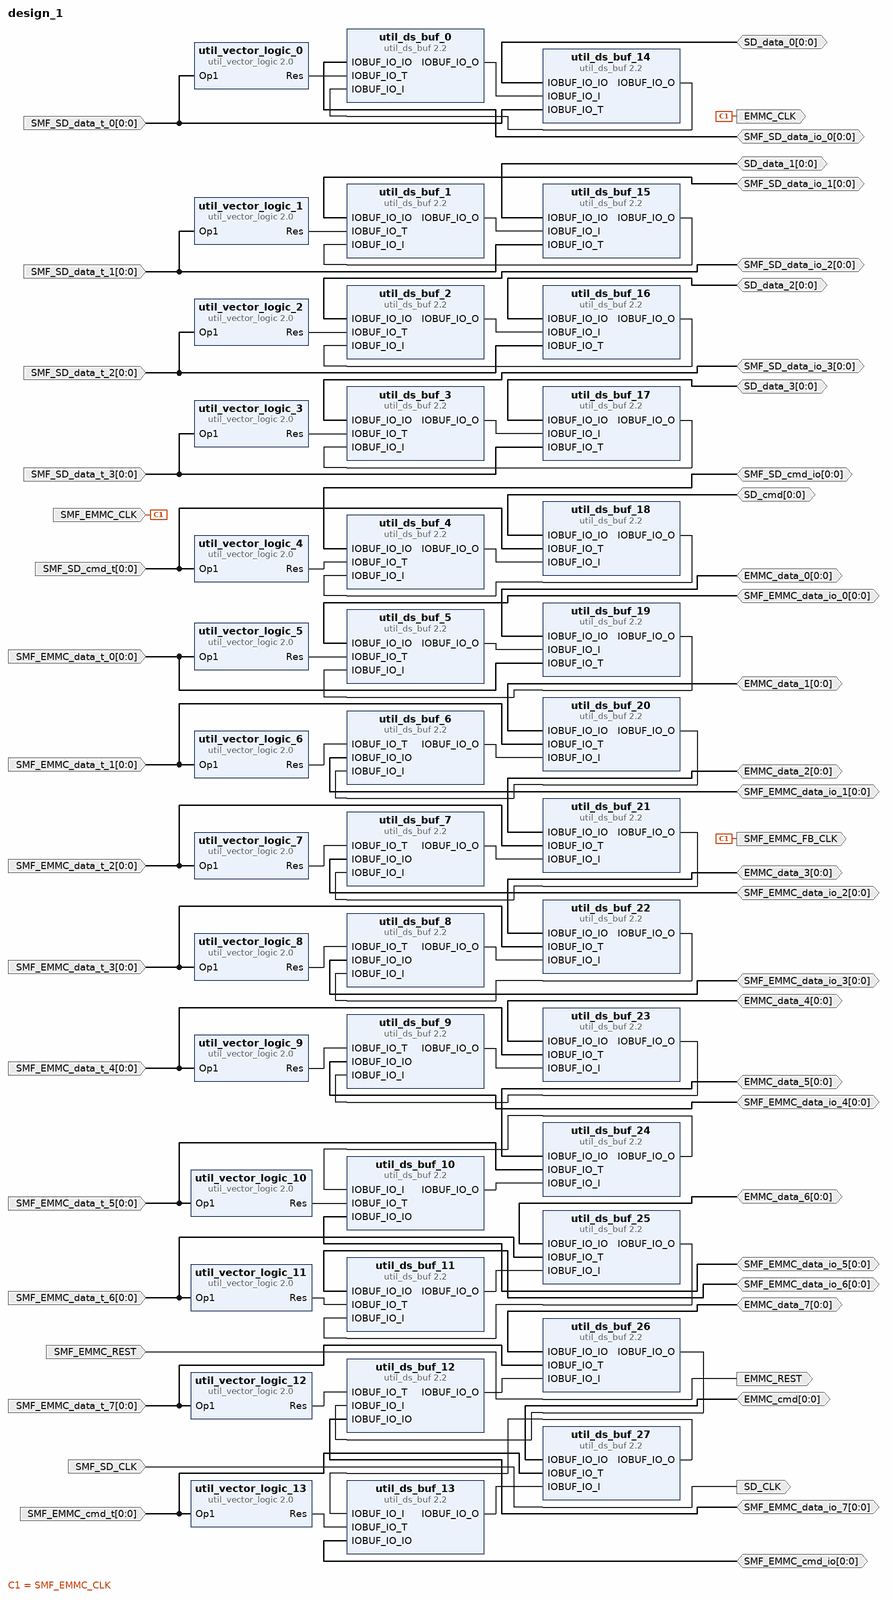
[diagram p0: block diagram of the top level]
# Vivado block design design_1, xcvu19p-fsva3824-2-e, Vivado 2022.2
create_bd_design design_1

create_bd_port -dir I -from 0 -to 0 SMF_SD_data_t_0
create_bd_port -dir I -from 0 -to 0 SMF_SD_data_t_2
create_bd_port -dir I -from 0 -to 0 SMF_SD_data_t_3
create_bd_port -dir IO -from 0 -to 0 SMF_SD_data_io_0
create_bd_port -dir IO -from 0 -to 0 SMF_SD_data_io_1
create_bd_port -dir IO -from 0 -to 0 SMF_SD_data_io_2
create_bd_port -dir IO -from 0 -to 0 SMF_SD_data_io_3
create_bd_port -dir IO -from 0 -to 0 SMF_SD_cmd_io
create_bd_port -dir I -from 0 -to 0 SMF_EMMC_data_t_0
create_bd_port -dir I -from 0 -to 0 SMF_EMMC_data_t_1
create_bd_port -dir I -from 0 -to 0 SMF_EMMC_data_t_2
create_bd_port -dir I -from 0 -to 0 SMF_EMMC_data_t_3
create_bd_port -dir I -from 0 -to 0 SMF_EMMC_data_t_4
create_bd_port -dir I -from 0 -to 0 SMF_EMMC_data_t_5
create_bd_port -dir I -from 0 -to 0 SMF_EMMC_data_t_6
create_bd_port -dir I -from 0 -to 0 SMF_EMMC_data_t_7
create_bd_port -dir I -from 0 -to 0 SMF_EMMC_cmd_t
create_bd_port -dir IO -from 0 -to 0 SMF_EMMC_data_io_0
create_bd_port -dir IO -from 0 -to 0 SMF_EMMC_data_io_1
create_bd_port -dir IO -from 0 -to 0 SMF_EMMC_data_io_2
create_bd_port -dir IO -from 0 -to 0 SMF_EMMC_data_io_3
create_bd_port -dir IO -from 0 -to 0 SMF_EMMC_data_io_4
create_bd_port -dir IO -from 0 -to 0 SMF_EMMC_data_io_5
create_bd_port -dir IO -from 0 -to 0 SMF_EMMC_data_io_6
create_bd_port -dir IO -from 0 -to 0 SMF_EMMC_data_io_7
create_bd_port -dir IO -from 0 -to 0 SMF_EMMC_cmd_io
create_bd_port -dir IO -from 0 -to 0 SD_data_0
create_bd_port -dir IO -from 0 -to 0 SD_data_1
create_bd_port -dir IO -from 0 -to 0 SD_data_2
create_bd_port -dir IO -from 0 -to 0 SD_data_3
create_bd_port -dir IO -from 0 -to 0 SD_cmd
create_bd_port -dir IO -from 0 -to 0 EMMC_data_0
create_bd_port -dir IO -from 0 -to 0 EMMC_data_1
create_bd_port -dir IO -from 0 -to 0 EMMC_data_2
create_bd_port -dir IO -from 0 -to 0 EMMC_data_3
create_bd_port -dir IO -from 0 -to 0 EMMC_data_4
create_bd_port -dir IO -from 0 -to 0 EMMC_data_5
create_bd_port -dir IO -from 0 -to 0 EMMC_data_6
create_bd_port -dir IO -from 0 -to 0 EMMC_data_7
create_bd_port -dir IO -from 0 -to 0 EMMC_cmd
create_bd_port -dir I -type clk SMF_SD_CLK
set_property -dict {CONFIG.FREQ_HZ 25000000} [get_bd_ports SMF_SD_CLK]
create_bd_port -dir O -type clk SD_CLK
set_property -dict {CONFIG.FREQ_HZ 25000000} [get_bd_ports SD_CLK]
create_bd_port -dir I -type clk SMF_EMMC_CLK
set_property -dict {CONFIG.FREQ_HZ 25000000} [get_bd_ports SMF_EMMC_CLK]
create_bd_port -dir O -type clk EMMC_CLK
set_property -dict {CONFIG.FREQ_HZ 25} [get_bd_ports EMMC_CLK]
create_bd_port -dir I -type data SMF_EMMC_REST
create_bd_port -dir O EMMC_REST
create_bd_port -dir I -from 0 -to 0 SMF_SD_cmd_t
create_bd_port -dir I -from 0 -to 0 SMF_SD_data_t_1
create_bd_port -dir O SMF_EMMC_FB_CLK

create_bd_cell -type ip -vlnv xilinx.com:ip:util_ds_buf:2.2 util_ds_buf_0
set_property -dict {CONFIG.C_BUF_TYPE IOBUF} [get_bd_cells util_ds_buf_0]
create_bd_cell -type ip -vlnv xilinx.com:ip:util_ds_buf:2.2 util_ds_buf_1
set_property -dict {CONFIG.C_BUF_TYPE IOBUF} [get_bd_cells util_ds_buf_1]
create_bd_cell -type ip -vlnv xilinx.com:ip:util_ds_buf:2.2 util_ds_buf_3
set_property -dict {CONFIG.C_BUF_TYPE IOBUF} [get_bd_cells util_ds_buf_3]
create_bd_cell -type ip -vlnv xilinx.com:ip:util_ds_buf:2.2 util_ds_buf_6
set_property -dict {CONFIG.C_BUF_TYPE IOBUF} [get_bd_cells util_ds_buf_6]
create_bd_cell -type ip -vlnv xilinx.com:ip:util_ds_buf:2.2 util_ds_buf_15
set_property -dict {CONFIG.C_BUF_TYPE IOBUF} [get_bd_cells util_ds_buf_15]
create_bd_cell -type ip -vlnv xilinx.com:ip:util_ds_buf:2.2 util_ds_buf_4
set_property -dict {CONFIG.C_BUF_TYPE IOBUF} [get_bd_cells util_ds_buf_4]
create_bd_cell -type ip -vlnv xilinx.com:ip:util_ds_buf:2.2 util_ds_buf_17
set_property -dict {CONFIG.C_BUF_TYPE IOBUF} [get_bd_cells util_ds_buf_17]
create_bd_cell -type ip -vlnv xilinx.com:ip:util_ds_buf:2.2 util_ds_buf_12
set_property -dict {CONFIG.C_BUF_TYPE IOBUF} [get_bd_cells util_ds_buf_12]
create_bd_cell -type ip -vlnv xilinx.com:ip:util_ds_buf:2.2 util_ds_buf_13
set_property -dict {CONFIG.C_BUF_TYPE IOBUF} [get_bd_cells util_ds_buf_13]
create_bd_cell -type ip -vlnv xilinx.com:ip:util_ds_buf:2.2 util_ds_buf_19
set_property -dict {CONFIG.C_BUF_TYPE IOBUF} [get_bd_cells util_ds_buf_19]
create_bd_cell -type ip -vlnv xilinx.com:ip:util_ds_buf:2.2 util_ds_buf_20
set_property -dict {CONFIG.C_BUF_TYPE IOBUF} [get_bd_cells util_ds_buf_20]
create_bd_cell -type ip -vlnv xilinx.com:ip:util_ds_buf:2.2 util_ds_buf_18
set_property -dict {CONFIG.C_BUF_TYPE IOBUF} [get_bd_cells util_ds_buf_18]
create_bd_cell -type ip -vlnv xilinx.com:ip:util_ds_buf:2.2 util_ds_buf_2
set_property -dict {CONFIG.C_BUF_TYPE IOBUF} [get_bd_cells util_ds_buf_2]
create_bd_cell -type ip -vlnv xilinx.com:ip:util_ds_buf:2.2 util_ds_buf_7
set_property -dict {CONFIG.C_BUF_TYPE IOBUF} [get_bd_cells util_ds_buf_7]
create_bd_cell -type ip -vlnv xilinx.com:ip:util_ds_buf:2.2 util_ds_buf_16
set_property -dict {CONFIG.C_BUF_TYPE IOBUF} [get_bd_cells util_ds_buf_16]
create_bd_cell -type ip -vlnv xilinx.com:ip:util_ds_buf:2.2 util_ds_buf_27
set_property -dict {CONFIG.C_BUF_TYPE IOBUF} [get_bd_cells util_ds_buf_27]
create_bd_cell -type ip -vlnv xilinx.com:ip:util_ds_buf:2.2 util_ds_buf_5
set_property -dict {CONFIG.C_BUF_TYPE IOBUF} [get_bd_cells util_ds_buf_5]
create_bd_cell -type ip -vlnv xilinx.com:ip:util_ds_buf:2.2 util_ds_buf_8
set_property -dict {CONFIG.C_BUF_TYPE IOBUF} [get_bd_cells util_ds_buf_8]
create_bd_cell -type ip -vlnv xilinx.com:ip:util_ds_buf:2.2 util_ds_buf_21
set_property -dict {CONFIG.C_BUF_TYPE IOBUF} [get_bd_cells util_ds_buf_21]
create_bd_cell -type ip -vlnv xilinx.com:ip:util_ds_buf:2.2 util_ds_buf_9
set_property -dict {CONFIG.C_BUF_TYPE IOBUF} [get_bd_cells util_ds_buf_9]
create_bd_cell -type ip -vlnv xilinx.com:ip:util_ds_buf:2.2 util_ds_buf_22
set_property -dict {CONFIG.C_BUF_TYPE IOBUF} [get_bd_cells util_ds_buf_22]
create_bd_cell -type ip -vlnv xilinx.com:ip:util_ds_buf:2.2 util_ds_buf_10
set_property -dict {CONFIG.C_BUF_TYPE IOBUF} [get_bd_cells util_ds_buf_10]
create_bd_cell -type ip -vlnv xilinx.com:ip:util_ds_buf:2.2 util_ds_buf_23
set_property -dict {CONFIG.C_BUF_TYPE IOBUF} [get_bd_cells util_ds_buf_23]
create_bd_cell -type ip -vlnv xilinx.com:ip:util_ds_buf:2.2 util_ds_buf_11
set_property -dict {CONFIG.C_BUF_TYPE IOBUF} [get_bd_cells util_ds_buf_11]
create_bd_cell -type ip -vlnv xilinx.com:ip:util_ds_buf:2.2 util_ds_buf_24
set_property -dict {CONFIG.C_BUF_TYPE IOBUF} [get_bd_cells util_ds_buf_24]
create_bd_cell -type ip -vlnv xilinx.com:ip:util_ds_buf:2.2 util_ds_buf_25
set_property -dict {CONFIG.C_BUF_TYPE IOBUF} [get_bd_cells util_ds_buf_25]
create_bd_cell -type ip -vlnv xilinx.com:ip:util_ds_buf:2.2 util_ds_buf_14
set_property -dict {CONFIG.C_BUF_TYPE IOBUF} [get_bd_cells util_ds_buf_14]
create_bd_cell -type ip -vlnv xilinx.com:ip:util_ds_buf:2.2 util_ds_buf_26
set_property -dict {CONFIG.C_BUF_TYPE IOBUF} [get_bd_cells util_ds_buf_26]
create_bd_cell -type ip -vlnv xilinx.com:ip:util_vector_logic:2.0 util_vector_logic_0
set_property -dict {CONFIG.C_OPERATION not CONFIG.C_SIZE 1} [get_bd_cells util_vector_logic_0]
create_bd_cell -type ip -vlnv xilinx.com:ip:util_vector_logic:2.0 util_vector_logic_1
set_property -dict {CONFIG.C_OPERATION not CONFIG.C_SIZE 1} [get_bd_cells util_vector_logic_1]
create_bd_cell -type ip -vlnv xilinx.com:ip:util_vector_logic:2.0 util_vector_logic_10
set_property -dict {CONFIG.C_OPERATION not CONFIG.C_SIZE 1} [get_bd_cells util_vector_logic_10]
create_bd_cell -type ip -vlnv xilinx.com:ip:util_vector_logic:2.0 util_vector_logic_11
set_property -dict {CONFIG.C_OPERATION not CONFIG.C_SIZE 1} [get_bd_cells util_vector_logic_11]
create_bd_cell -type ip -vlnv xilinx.com:ip:util_vector_logic:2.0 util_vector_logic_12
set_property -dict {CONFIG.C_OPERATION not CONFIG.C_SIZE 1} [get_bd_cells util_vector_logic_12]
create_bd_cell -type ip -vlnv xilinx.com:ip:util_vector_logic:2.0 util_vector_logic_13
set_property -dict {CONFIG.C_OPERATION not CONFIG.C_SIZE 1} [get_bd_cells util_vector_logic_13]
create_bd_cell -type ip -vlnv xilinx.com:ip:util_vector_logic:2.0 util_vector_logic_4
set_property -dict {CONFIG.C_OPERATION not CONFIG.C_SIZE 1} [get_bd_cells util_vector_logic_4]
create_bd_cell -type ip -vlnv xilinx.com:ip:util_vector_logic:2.0 util_vector_logic_2
set_property -dict {CONFIG.C_OPERATION not CONFIG.C_SIZE 1} [get_bd_cells util_vector_logic_2]
create_bd_cell -type ip -vlnv xilinx.com:ip:util_vector_logic:2.0 util_vector_logic_3
set_property -dict {CONFIG.C_OPERATION not CONFIG.C_SIZE 1} [get_bd_cells util_vector_logic_3]
create_bd_cell -type ip -vlnv xilinx.com:ip:util_vector_logic:2.0 util_vector_logic_5
set_property -dict {CONFIG.C_OPERATION not CONFIG.C_SIZE 1} [get_bd_cells util_vector_logic_5]
create_bd_cell -type ip -vlnv xilinx.com:ip:util_vector_logic:2.0 util_vector_logic_6
set_property -dict {CONFIG.C_OPERATION not CONFIG.C_SIZE 1} [get_bd_cells util_vector_logic_6]
create_bd_cell -type ip -vlnv xilinx.com:ip:util_vector_logic:2.0 util_vector_logic_7
set_property -dict {CONFIG.C_OPERATION not CONFIG.C_SIZE 1} [get_bd_cells util_vector_logic_7]
create_bd_cell -type ip -vlnv xilinx.com:ip:util_vector_logic:2.0 util_vector_logic_8
set_property -dict {CONFIG.C_OPERATION not CONFIG.C_SIZE 1} [get_bd_cells util_vector_logic_8]
create_bd_cell -type ip -vlnv xilinx.com:ip:util_vector_logic:2.0 util_vector_logic_9
set_property -dict {CONFIG.C_OPERATION not CONFIG.C_SIZE 1} [get_bd_cells util_vector_logic_9]

# ---- connections ----

connect_bd_net [get_bd_ports EMMC_cmd] [get_bd_pins util_ds_buf_27/IOBUF_IO_IO]
connect_bd_net [get_bd_ports EMMC_data_0] [get_bd_pins util_ds_buf_19/IOBUF_IO_IO]
connect_bd_net [get_bd_ports EMMC_data_1] [get_bd_pins util_ds_buf_20/IOBUF_IO_IO]
connect_bd_net [get_bd_ports EMMC_data_2] [get_bd_pins util_ds_buf_21/IOBUF_IO_IO]
connect_bd_net [get_bd_ports EMMC_data_3] [get_bd_pins util_ds_buf_22/IOBUF_IO_IO]
connect_bd_net [get_bd_ports EMMC_data_4] [get_bd_pins util_ds_buf_23/IOBUF_IO_IO]
connect_bd_net [get_bd_ports EMMC_data_5] [get_bd_pins util_ds_buf_24/IOBUF_IO_IO]
connect_bd_net [get_bd_ports EMMC_data_6] [get_bd_pins util_ds_buf_25/IOBUF_IO_IO]
connect_bd_net [get_bd_ports EMMC_data_7] [get_bd_pins util_ds_buf_26/IOBUF_IO_IO]
connect_bd_net -net Op1_0_1 [get_bd_ports SMF_SD_cmd_t] [get_bd_pins util_ds_buf_18/IOBUF_IO_T] [get_bd_pins util_vector_logic_4/Op1]
connect_bd_net [get_bd_ports SD_cmd] [get_bd_pins util_ds_buf_18/IOBUF_IO_IO]
connect_bd_net [get_bd_ports SD_data_0] [get_bd_pins util_ds_buf_14/IOBUF_IO_IO]
connect_bd_net [get_bd_ports SD_data_1] [get_bd_pins util_ds_buf_15/IOBUF_IO_IO]
connect_bd_net [get_bd_ports SD_data_2] [get_bd_pins util_ds_buf_16/IOBUF_IO_IO]
connect_bd_net [get_bd_ports SD_data_3] [get_bd_pins util_ds_buf_17/IOBUF_IO_IO]
connect_bd_net [get_bd_ports SMF_EMMC_CLK] [get_bd_ports EMMC_CLK] [get_bd_ports SMF_EMMC_FB_CLK]
connect_bd_net [get_bd_ports SMF_EMMC_REST] [get_bd_ports EMMC_REST]
connect_bd_net [get_bd_ports SMF_EMMC_cmd_t] [get_bd_pins util_ds_buf_27/IOBUF_IO_T] [get_bd_pins util_vector_logic_13/Op1]
connect_bd_net [get_bd_ports SMF_EMMC_data_io_0] [get_bd_pins util_ds_buf_5/IOBUF_IO_IO]
connect_bd_net [get_bd_ports SMF_EMMC_data_io_1] [get_bd_pins util_ds_buf_6/IOBUF_IO_IO]
connect_bd_net [get_bd_ports SMF_EMMC_data_io_2] [get_bd_pins util_ds_buf_7/IOBUF_IO_IO]
connect_bd_net [get_bd_ports SMF_EMMC_data_io_3] [get_bd_pins util_ds_buf_8/IOBUF_IO_IO]
connect_bd_net [get_bd_ports SMF_EMMC_data_io_4] [get_bd_pins util_ds_buf_9/IOBUF_IO_IO]
connect_bd_net [get_bd_ports SMF_EMMC_data_io_5] [get_bd_pins util_ds_buf_10/IOBUF_IO_IO]
connect_bd_net [get_bd_ports SMF_EMMC_data_io_6] [get_bd_pins util_ds_buf_11/IOBUF_IO_IO]
connect_bd_net [get_bd_ports SMF_EMMC_data_io_7] [get_bd_pins util_ds_buf_12/IOBUF_IO_IO]
connect_bd_net [get_bd_ports SMF_EMMC_data_t_0] [get_bd_pins util_ds_buf_19/IOBUF_IO_T] [get_bd_pins util_vector_logic_5/Op1]
connect_bd_net [get_bd_ports SMF_EMMC_data_t_1] [get_bd_pins util_ds_buf_20/IOBUF_IO_T] [get_bd_pins util_vector_logic_6/Op1]
connect_bd_net [get_bd_ports SMF_EMMC_data_t_2] [get_bd_pins util_ds_buf_21/IOBUF_IO_T] [get_bd_pins util_vector_logic_7/Op1]
connect_bd_net [get_bd_ports SMF_EMMC_data_t_3] [get_bd_pins util_ds_buf_22/IOBUF_IO_T] [get_bd_pins util_vector_logic_8/Op1]
connect_bd_net [get_bd_ports SMF_EMMC_data_t_4] [get_bd_pins util_ds_buf_23/IOBUF_IO_T] [get_bd_pins util_vector_logic_9/Op1]
connect_bd_net [get_bd_ports SMF_EMMC_data_t_5] [get_bd_pins util_ds_buf_24/IOBUF_IO_T] [get_bd_pins util_vector_logic_10/Op1]
connect_bd_net [get_bd_ports SMF_EMMC_data_t_6] [get_bd_pins util_ds_buf_25/IOBUF_IO_T] [get_bd_pins util_vector_logic_11/Op1]
connect_bd_net [get_bd_ports SMF_EMMC_data_t_7] [get_bd_pins util_ds_buf_26/IOBUF_IO_T] [get_bd_pins util_vector_logic_12/Op1]
connect_bd_net -net SMF_SDIO_1_0_cmd_io [get_bd_ports SMF_EMMC_cmd_io] [get_bd_pins util_ds_buf_13/IOBUF_IO_IO]
connect_bd_net -net SMF_SD_0_data_io_3 [get_bd_ports SMF_SD_data_io_3] [get_bd_pins util_ds_buf_3/IOBUF_IO_IO]
connect_bd_net [get_bd_ports SMF_SD_CLK] [get_bd_ports SD_CLK]
connect_bd_net [get_bd_ports SMF_SD_cmd_io] [get_bd_pins util_ds_buf_4/IOBUF_IO_IO]
connect_bd_net [get_bd_ports SMF_SD_data_io_0] [get_bd_pins util_ds_buf_0/IOBUF_IO_IO]
connect_bd_net [get_bd_ports SMF_SD_data_io_1] [get_bd_pins util_ds_buf_1/IOBUF_IO_IO]
connect_bd_net [get_bd_ports SMF_SD_data_io_2] [get_bd_pins util_ds_buf_2/IOBUF_IO_IO]
connect_bd_net [get_bd_ports SMF_SD_data_t_0] [get_bd_pins util_ds_buf_14/IOBUF_IO_T] [get_bd_pins util_vector_logic_0/Op1]
connect_bd_net [get_bd_ports SMF_SD_data_t_1] [get_bd_pins util_ds_buf_15/IOBUF_IO_T] [get_bd_pins util_vector_logic_1/Op1]
connect_bd_net [get_bd_ports SMF_SD_data_t_2] [get_bd_pins util_ds_buf_16/IOBUF_IO_T] [get_bd_pins util_vector_logic_2/Op1]
connect_bd_net [get_bd_ports SMF_SD_data_t_3] [get_bd_pins util_ds_buf_17/IOBUF_IO_T] [get_bd_pins util_vector_logic_3/Op1]
connect_bd_net [get_bd_pins util_ds_buf_0/IOBUF_IO_O] [get_bd_pins util_ds_buf_14/IOBUF_IO_I]
connect_bd_net [get_bd_pins util_ds_buf_10/IOBUF_IO_O] [get_bd_pins util_ds_buf_24/IOBUF_IO_I]
connect_bd_net [get_bd_pins util_ds_buf_11/IOBUF_IO_O] [get_bd_pins util_ds_buf_25/IOBUF_IO_I]
connect_bd_net [get_bd_pins util_ds_buf_12/IOBUF_IO_O] [get_bd_pins util_ds_buf_26/IOBUF_IO_I]
connect_bd_net [get_bd_pins util_ds_buf_13/IOBUF_IO_O] [get_bd_pins util_ds_buf_27/IOBUF_IO_I]
connect_bd_net [get_bd_pins util_ds_buf_14/IOBUF_IO_O] [get_bd_pins util_ds_buf_0/IOBUF_IO_I]
connect_bd_net [get_bd_pins util_ds_buf_15/IOBUF_IO_O] [get_bd_pins util_ds_buf_1/IOBUF_IO_I]
connect_bd_net [get_bd_pins util_ds_buf_16/IOBUF_IO_O] [get_bd_pins util_ds_buf_2/IOBUF_IO_I]
connect_bd_net [get_bd_pins util_ds_buf_17/IOBUF_IO_O] [get_bd_pins util_ds_buf_3/IOBUF_IO_I]
connect_bd_net [get_bd_pins util_ds_buf_18/IOBUF_IO_O] [get_bd_pins util_ds_buf_4/IOBUF_IO_I]
connect_bd_net [get_bd_pins util_ds_buf_19/IOBUF_IO_O] [get_bd_pins util_ds_buf_5/IOBUF_IO_I]
connect_bd_net [get_bd_pins util_ds_buf_1/IOBUF_IO_O] [get_bd_pins util_ds_buf_15/IOBUF_IO_I]
connect_bd_net [get_bd_pins util_ds_buf_20/IOBUF_IO_O] [get_bd_pins util_ds_buf_6/IOBUF_IO_I]
connect_bd_net [get_bd_pins util_ds_buf_21/IOBUF_IO_O] [get_bd_pins util_ds_buf_7/IOBUF_IO_I]
connect_bd_net [get_bd_pins util_ds_buf_22/IOBUF_IO_O] [get_bd_pins util_ds_buf_8/IOBUF_IO_I]
connect_bd_net [get_bd_pins util_ds_buf_23/IOBUF_IO_O] [get_bd_pins util_ds_buf_9/IOBUF_IO_I]
connect_bd_net [get_bd_pins util_ds_buf_24/IOBUF_IO_O] [get_bd_pins util_ds_buf_10/IOBUF_IO_I]
connect_bd_net [get_bd_pins util_ds_buf_25/IOBUF_IO_O] [get_bd_pins util_ds_buf_11/IOBUF_IO_I]
connect_bd_net [get_bd_pins util_ds_buf_26/IOBUF_IO_O] [get_bd_pins util_ds_buf_12/IOBUF_IO_I]
connect_bd_net [get_bd_pins util_ds_buf_27/IOBUF_IO_O] [get_bd_pins util_ds_buf_13/IOBUF_IO_I]
connect_bd_net [get_bd_pins util_ds_buf_2/IOBUF_IO_O] [get_bd_pins util_ds_buf_16/IOBUF_IO_I]
connect_bd_net [get_bd_pins util_ds_buf_3/IOBUF_IO_O] [get_bd_pins util_ds_buf_17/IOBUF_IO_I]
connect_bd_net [get_bd_pins util_ds_buf_4/IOBUF_IO_O] [get_bd_pins util_ds_buf_18/IOBUF_IO_I]
connect_bd_net [get_bd_pins util_ds_buf_5/IOBUF_IO_O] [get_bd_pins util_ds_buf_19/IOBUF_IO_I]
connect_bd_net [get_bd_pins util_ds_buf_6/IOBUF_IO_O] [get_bd_pins util_ds_buf_20/IOBUF_IO_I]
connect_bd_net [get_bd_pins util_ds_buf_7/IOBUF_IO_O] [get_bd_pins util_ds_buf_21/IOBUF_IO_I]
connect_bd_net [get_bd_pins util_ds_buf_8/IOBUF_IO_O] [get_bd_pins util_ds_buf_22/IOBUF_IO_I]
connect_bd_net [get_bd_pins util_ds_buf_9/IOBUF_IO_O] [get_bd_pins util_ds_buf_23/IOBUF_IO_I]
connect_bd_net [get_bd_pins util_vector_logic_0/Res] [get_bd_pins util_ds_buf_0/IOBUF_IO_T]
connect_bd_net [get_bd_pins util_vector_logic_10/Res] [get_bd_pins util_ds_buf_10/IOBUF_IO_T]
connect_bd_net [get_bd_pins util_vector_logic_11/Res] [get_bd_pins util_ds_buf_11/IOBUF_IO_T]
connect_bd_net [get_bd_pins util_vector_logic_12/Res] [get_bd_pins util_ds_buf_12/IOBUF_IO_T]
connect_bd_net [get_bd_pins util_vector_logic_13/Res] [get_bd_pins util_ds_buf_13/IOBUF_IO_T]
connect_bd_net [get_bd_pins util_vector_logic_1/Res] [get_bd_pins util_ds_buf_1/IOBUF_IO_T]
connect_bd_net [get_bd_pins util_vector_logic_2/Res] [get_bd_pins util_ds_buf_2/IOBUF_IO_T]
connect_bd_net [get_bd_pins util_vector_logic_3/Res] [get_bd_pins util_ds_buf_3/IOBUF_IO_T]
connect_bd_net [get_bd_pins util_vector_logic_4/Res] [get_bd_pins util_ds_buf_4/IOBUF_IO_T]
connect_bd_net [get_bd_pins util_vector_logic_5/Res] [get_bd_pins util_ds_buf_5/IOBUF_IO_T]
connect_bd_net [get_bd_pins util_vector_logic_6/Res] [get_bd_pins util_ds_buf_6/IOBUF_IO_T]
connect_bd_net [get_bd_pins util_vector_logic_7/Res] [get_bd_pins util_ds_buf_7/IOBUF_IO_T]
connect_bd_net [get_bd_pins util_vector_logic_8/Res] [get_bd_pins util_ds_buf_8/IOBUF_IO_T]
connect_bd_net [get_bd_pins util_vector_logic_9/Res] [get_bd_pins util_ds_buf_9/IOBUF_IO_T]

validate_bd_design
save_bd_design
